# Altium project Matrix_Button.PrjPcb
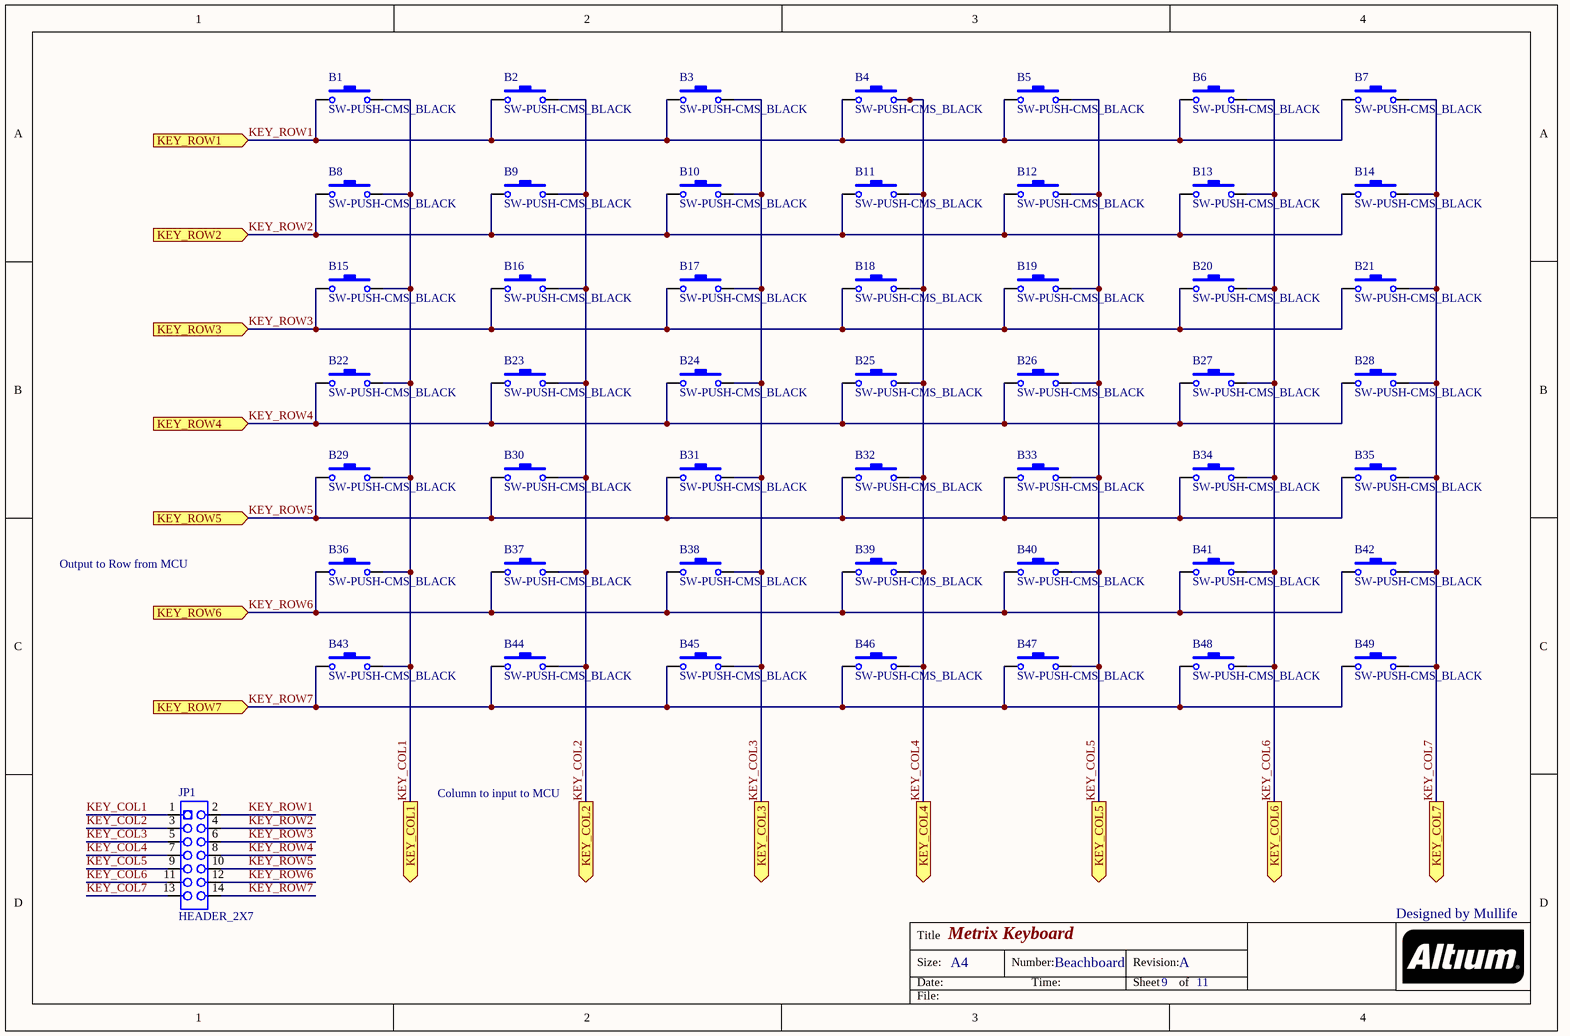
[diagram p0: Matrix_Buttons_v0.0.1.SchDoc]
1 sheet, 50 parts. Net scope: flat (ports and power ports of the same name join across sheets).
Board file: Matrix_Buttons_v0.0.1.PcbDoc

## Sheet Matrix_Buttons_v0.0.1.SchDoc: Metrix Keyboard
size A4; DocumentNumber: Beachboard; Revision: A; SheetNumber: 9; SheetTotal: 11

### Parts
B1  SW-PUSH-CMS_BLACK  [SWI_WEALTHMETAL_TD-0341_4P - BACK]
B2  SW-PUSH-CMS_BLACK  [SWI_WEALTHMETAL_TD-0341_4P - BACK]
B3  SW-PUSH-CMS_BLACK  [SWI_WEALTHMETAL_TD-0341_4P - BACK]
B4  SW-PUSH-CMS_BLACK  [SWI_WEALTHMETAL_TD-0341_4P - BACK]
B5  SW-PUSH-CMS_BLACK  [SWI_WEALTHMETAL_TD-0341_4P - BACK]
B6  SW-PUSH-CMS_BLACK  [SWI_WEALTHMETAL_TD-0341_4P - BACK]
B7  SW-PUSH-CMS_BLACK  [SWI_WEALTHMETAL_TD-0341_4P - BACK]
B8  SW-PUSH-CMS_BLACK  [SWI_WEALTHMETAL_TD-0341_4P - BACK]
B9  SW-PUSH-CMS_BLACK  [SWI_WEALTHMETAL_TD-0341_4P - BACK]
B10  SW-PUSH-CMS_BLACK  [SWI_WEALTHMETAL_TD-0341_4P - BACK]
B11  SW-PUSH-CMS_BLACK  [SWI_WEALTHMETAL_TD-0341_4P - BACK]
B12  SW-PUSH-CMS_BLACK  [SWI_WEALTHMETAL_TD-0341_4P - BACK]
B13  SW-PUSH-CMS_BLACK  [SWI_WEALTHMETAL_TD-0341_4P - BACK]
B14  SW-PUSH-CMS_BLACK  [SWI_WEALTHMETAL_TD-0341_4P - BACK]
B15  SW-PUSH-CMS_BLACK  [SWI_WEALTHMETAL_TD-0341_4P - BACK]
B16  SW-PUSH-CMS_BLACK  [SWI_WEALTHMETAL_TD-0341_4P - BACK]
B17  SW-PUSH-CMS_BLACK  [SWI_WEALTHMETAL_TD-0341_4P - BACK]
B18  SW-PUSH-CMS_BLACK  [SWI_WEALTHMETAL_TD-0341_4P - BACK]
B19  SW-PUSH-CMS_BLACK  [SWI_WEALTHMETAL_TD-0341_4P - BACK]
B20  SW-PUSH-CMS_BLACK  [SWI_WEALTHMETAL_TD-0341_4P - BACK]
B21  SW-PUSH-CMS_BLACK  [SWI_WEALTHMETAL_TD-0341_4P - BACK]
B22  SW-PUSH-CMS_BLACK  [SWI_WEALTHMETAL_TD-0341_4P - BACK]
B23  SW-PUSH-CMS_BLACK  [SWI_WEALTHMETAL_TD-0341_4P - BACK]
B24  SW-PUSH-CMS_BLACK  [SWI_WEALTHMETAL_TD-0341_4P - BACK]
B25  SW-PUSH-CMS_BLACK  [SWI_WEALTHMETAL_TD-0341_4P - BACK]
B26  SW-PUSH-CMS_BLACK  [SWI_WEALTHMETAL_TD-0341_4P - BACK]
B27  SW-PUSH-CMS_BLACK  [SWI_WEALTHMETAL_TD-0341_4P - BACK]
B28  SW-PUSH-CMS_BLACK  [SWI_WEALTHMETAL_TD-0341_4P - BACK]
B29  SW-PUSH-CMS_BLACK  [SWI_WEALTHMETAL_TD-0341_4P - BACK]
B30  SW-PUSH-CMS_BLACK  [SWI_WEALTHMETAL_TD-0341_4P - BACK]
B31  SW-PUSH-CMS_BLACK  [SWI_WEALTHMETAL_TD-0341_4P - BACK]
B32  SW-PUSH-CMS_BLACK  [SWI_WEALTHMETAL_TD-0341_4P - BACK]
B33  SW-PUSH-CMS_BLACK  [SWI_WEALTHMETAL_TD-0341_4P - BACK]
B34  SW-PUSH-CMS_BLACK  [SWI_WEALTHMETAL_TD-0341_4P - BACK]
B35  SW-PUSH-CMS_BLACK  [SWI_WEALTHMETAL_TD-0341_4P - BACK]
B36  SW-PUSH-CMS_BLACK  [SWI_WEALTHMETAL_TD-0341_4P - BACK]
B37  SW-PUSH-CMS_BLACK  [SWI_WEALTHMETAL_TD-0341_4P - BACK]
B38  SW-PUSH-CMS_BLACK  [SWI_WEALTHMETAL_TD-0341_4P - BACK]
B39  SW-PUSH-CMS_BLACK  [SWI_WEALTHMETAL_TD-0341_4P - BACK]
B40  SW-PUSH-CMS_BLACK  [SWI_WEALTHMETAL_TD-0341_4P - BACK]
B41  SW-PUSH-CMS_BLACK  [SWI_WEALTHMETAL_TD-0341_4P - BACK]
B42  SW-PUSH-CMS_BLACK  [SWI_WEALTHMETAL_TD-0341_4P - BACK]
B43  SW-PUSH-CMS_BLACK  [SWI_WEALTHMETAL_TD-0341_4P - BACK]
B44  SW-PUSH-CMS_BLACK  [SWI_WEALTHMETAL_TD-0341_4P - BACK]
B45  SW-PUSH-CMS_BLACK  [SWI_WEALTHMETAL_TD-0341_4P - BACK]
B46  SW-PUSH-CMS_BLACK  [SWI_WEALTHMETAL_TD-0341_4P - BACK]
B47  SW-PUSH-CMS_BLACK  [SWI_WEALTHMETAL_TD-0341_4P - BACK]
B48  SW-PUSH-CMS_BLACK  [SWI_WEALTHMETAL_TD-0341_4P - BACK]
B49  SW-PUSH-CMS_BLACK  [SWI_WEALTHMETAL_TD-0341_4P - BACK]
JP1  HEADER_2X7  [Header M 2x7x2.54 TH V]

### Ports
KEY_COL1, KEY_COL2, KEY_COL3, KEY_COL4, KEY_COL5, KEY_COL6, KEY_COL7, KEY_ROW1, KEY_ROW2, KEY_ROW3, KEY_ROW4, KEY_ROW5, KEY_ROW6, KEY_ROW7

### Nets
KEY_COL1: B1.2 B8.2 B15.2 B22.2 B29.2 B36.2 B43.2 JP1.1 ; port KEY_COL1
KEY_COL2: B2.2 B9.2 B16.2 B23.2 B30.2 B37.2 B44.2 JP1.3 ; port KEY_COL2
KEY_COL3: B3.2 B10.2 B17.2 B24.2 B31.2 B38.2 B45.2 JP1.5 ; port KEY_COL3
KEY_COL4: B4.2 B11.2 B18.2 B25.2 B32.2 B39.2 B46.2 JP1.7 ; port KEY_COL4
KEY_COL5: B5.2 B12.2 B19.2 B26.2 B33.2 B40.2 B47.2 JP1.9 ; port KEY_COL5
KEY_COL6: B6.2 B13.2 B20.2 B27.2 B34.2 B41.2 B48.2 JP1.11 ; port KEY_COL6
KEY_COL7: B7.2 B14.2 B21.2 B28.2 B35.2 B42.2 B49.2 JP1.13 ; port KEY_COL7
KEY_ROW1: B1.1 B2.1 B3.1 B4.1 B5.1 B6.1 B7.1 JP1.2 ; port KEY_ROW1
KEY_ROW2: B8.1 B9.1 B10.1 B11.1 B12.1 B13.1 B14.1 JP1.4 ; port KEY_ROW2
KEY_ROW3: B15.1 B16.1 B17.1 B18.1 B19.1 B20.1 B21.1 JP1.6 ; port KEY_ROW3
KEY_ROW4: B22.1 B23.1 B24.1 B25.1 B26.1 B27.1 B28.1 JP1.8 ; port KEY_ROW4
KEY_ROW5: B29.1 B30.1 B31.1 B32.1 B33.1 B34.1 B35.1 JP1.10 ; port KEY_ROW5
KEY_ROW6: B36.1 B37.1 B38.1 B39.1 B40.1 B41.1 B42.1 JP1.12 ; port KEY_ROW6
KEY_ROW7: B43.1 B44.1 B45.1 B46.1 B47.1 B48.1 B49.1 JP1.14 ; port KEY_ROW7

### Notes on the sheet
- Output to Row from MCU
- Column to input to MCU
- Designed by Mullife
- Title
- Size:
- Date:
- A4
- Number:
- Time:
- Revision:
- Sheet
- of
- File:

### Library data of the parts
B1-B49 = SW-PB_2: Push-button SMD; Order code RS: 102-412